# Altium project Zillion.PrjPcb
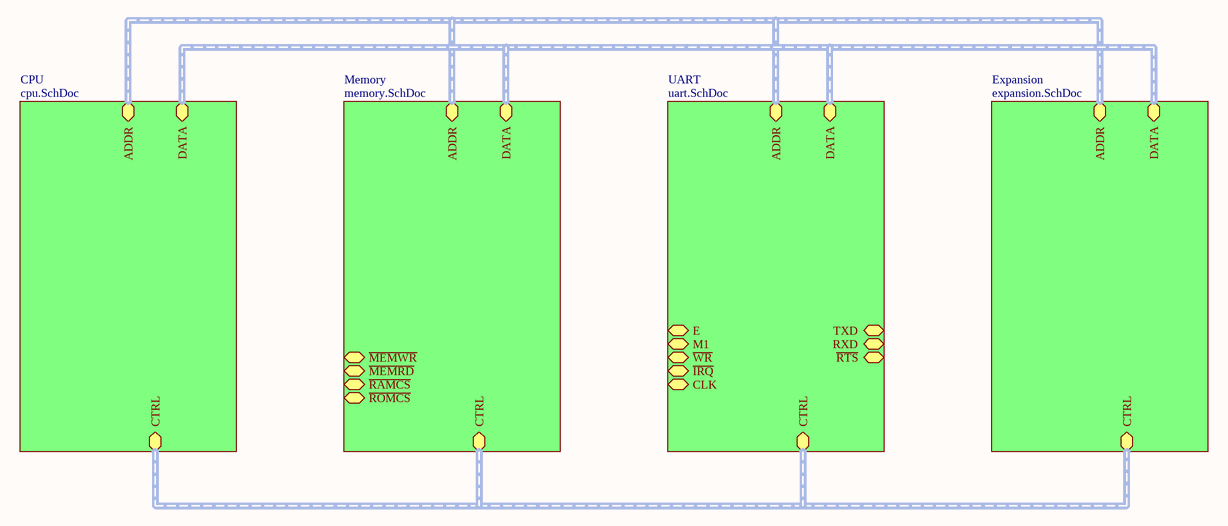
[diagram p0: Zillion.SchDoc]
5 sheets, 78 parts. Net scope: hierarchical (ports join the sheet entries above them; power ports are global).
Board file: Zillion.PcbDoc
Sheets:
  Zillion.SchDoc
    CPU = cpu.SchDoc
    Memory = memory.SchDoc
    UART = uart.SchDoc
    Expansion = expansion.SchDoc

## Sheet Zillion.SchDoc: Zillion - Z80 Single Board Computer
size A4; Author: Francesco Sacco; Revision: 0; ProjectName: Zillion - Z80 Single Board Computer

### Sub-sheets
CPU = cpu.SchDoc: ADDR (harness ADDR), DATA (harness DATA), CTRL (harness CTRL)
Expansion = expansion.SchDoc: ADDR (harness ADDR), DATA (harness DATA), CTRL (harness CTRL)
Memory = memory.SchDoc: ADDR (harness ADDR), DATA (harness DATA), CTRL (harness CTRL), ~{MEMWR}, ~{MEMRD}, ~{RAMCS}, ~{ROMCS}
UART = uart.SchDoc: ADDR (harness ADDR), DATA (harness DATA), CTRL (harness CTRL), E, M1, ~{WR}, ~{IRQ}, CLK, ~{RTS}, TXD, RXD

### Buses and harness runs
harness sheet CPU/ADDR = sheet Expansion/ADDR = sheet Memory/ADDR = sheet UART/ADDR
harness sheet CPU/CTRL = sheet Expansion/CTRL = sheet Memory/CTRL = sheet UART/CTRL
harness sheet CPU/DATA = sheet Expansion/DATA = sheet Memory/DATA = sheet UART/DATA

## Sheet cpu.SchDoc: Zillion - Z80 Single Board Computer
size A4; Author: Francesco Sacco; Revision: 0; ProjectName: Zillion - Z80 Single Board Computer
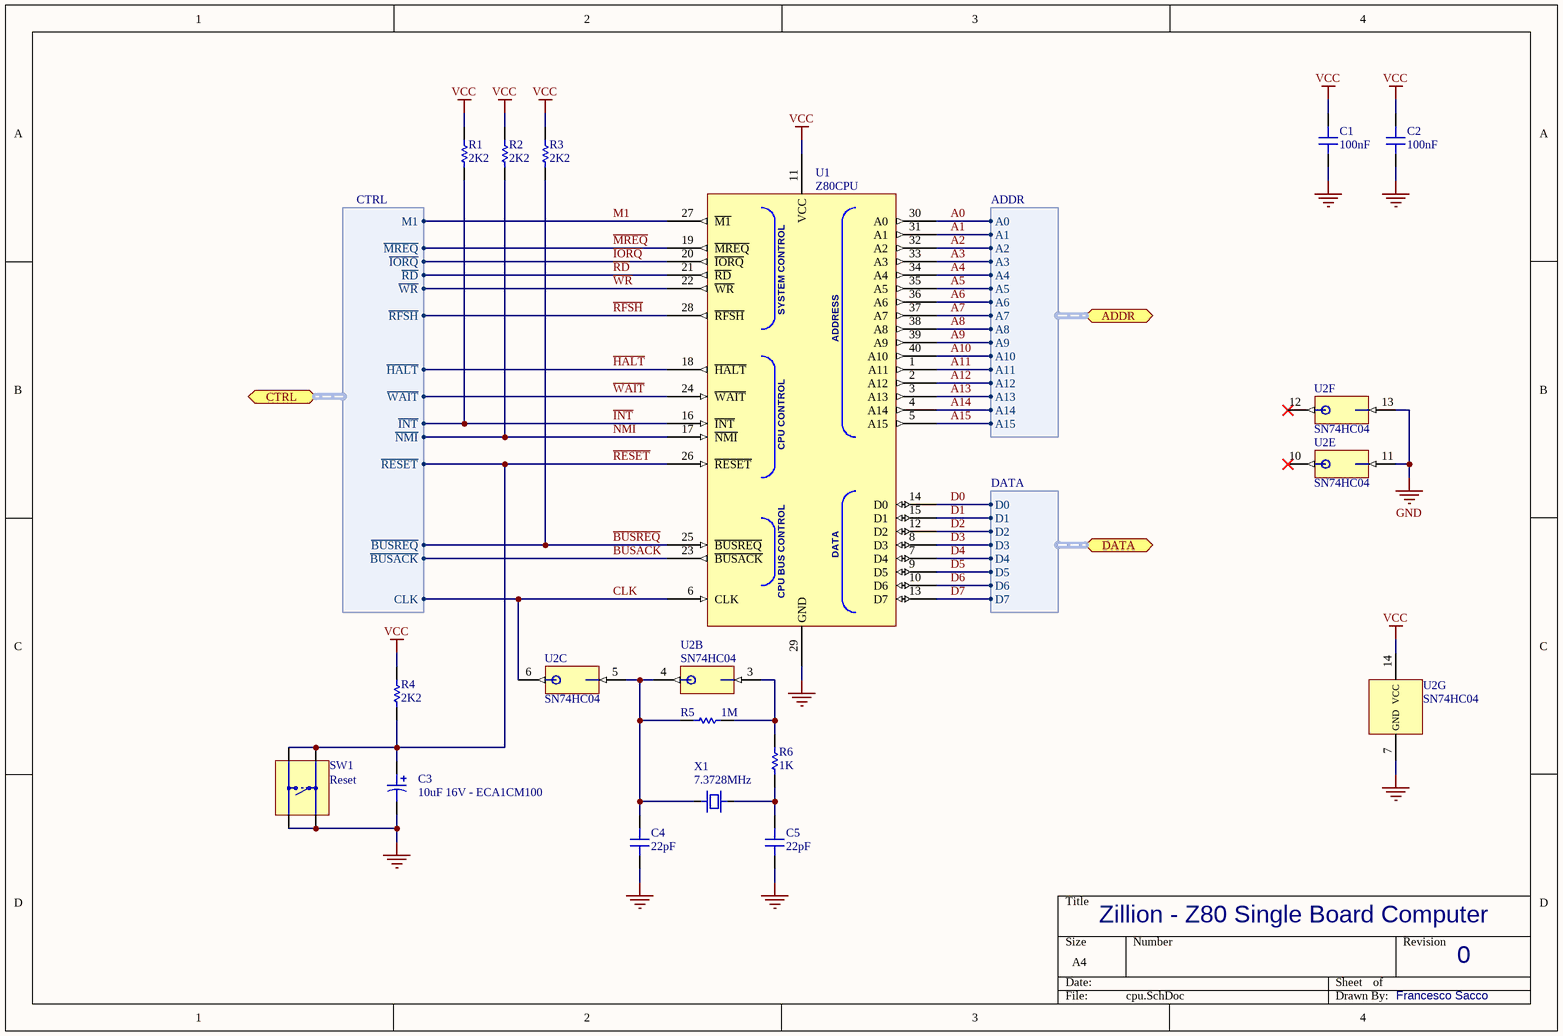
[diagram p1: cpu.SchDoc]

### Parts
C1  100nF  [DiskCapacitor]
C2  100nF  [DiskCapacitor]
C3  10uF 16V - ECA1CM100  [ECA 5x11]
C4  22pF  [DiskCapacitor]
C5  22pF  [DiskCapacitor]
R1  2K2  [CR12]
R2  2K2  [CR12]
R3  2K2  [CR12]
R4  2K2  [CR12]
R5  1M  [CR12]
R6  1K  [CR12]
SW1  Reset  [EVQPAx09K]
U1  Z80CPU  [Z84C00xxPEG]
U2  SN74HC04  [CDIP14]  (parts B,C,E,F,G of 7)
X1  7.3728MHz  [HC49S]

### Ports
ADDR (harness ADDR), CTRL (harness CTRL), DATA (harness DATA)

### Harnesses
ADDR: A0, A1, A2, A3, A4, A5, A6, A7, A8, A9, A10, A11, A12, A13, A14, A15
DATA: D0, D1, D2, D3, D4, D5, D6, D7
CTRL: M1, ~{MREQ}, ~{IORQ}, ~{RD}, ~{WR}, ~{RFSH}, ~{HALT}, ~{WAIT}, ~{INT}, ~{NMI}, ~{RESET}, ~{BUSREQ}, ~{BUSACK}, CLK

### Nets
GND: C1.1 C2.1 C3.2 C4.1 C5.1 SW1.1 SW1.2 U1.29(GND) U2.7(GND) U2.11(A) U2.13(A)
VCC: C1.2 C2.2 R1.2 R2.2 R3.2 R4.2 U1.11(VCC) U2.14(VCC)
A0: U1.30(A0) ; port ADDR.A0
A1: U1.31(A1) ; port ADDR.A1
A2: U1.32(A2) ; port ADDR.A2
A3: U1.33(A3) ; port ADDR.A3
A4: U1.34(A4) ; port ADDR.A4
A5: U1.35(A5) ; port ADDR.A5
A6: U1.36(A6) ; port ADDR.A6
A7: U1.37(A7) ; port ADDR.A7
A8: U1.38(A8) ; port ADDR.A8
A9: U1.39(A9) ; port ADDR.A9
A10: U1.40(A10) ; port ADDR.A10
A11: U1.1(A11) ; port ADDR.A11
A12: U1.2(A12) ; port ADDR.A12
A13: U1.3(A13) ; port ADDR.A13
A14: U1.4(A14) ; port ADDR.A14
A15: U1.5(A15) ; port ADDR.A15
~{BUSACK}: U1.23(~{BUSACK}) ; port CTRL.~{BUSACK}
~{BUSREQ}: R3.1 U1.25(~{BUSREQ}) ; port CTRL.~{BUSREQ}
CLK: U1.6(CLK) U2.6(Y) ; port CTRL.CLK
D0: U1.14(D0) ; port DATA.D0
D1: U1.15(D1) ; port DATA.D1
D2: U1.12(D2) ; port DATA.D2
D3: U1.8(D3) ; port DATA.D3
D4: U1.7(D4) ; port DATA.D4
D5: U1.9(D5) ; port DATA.D5
D6: U1.10(D6) ; port DATA.D6
D7: U1.13(D7) ; port DATA.D7
~{HALT}: U1.18(~{HALT}) ; port CTRL.~{HALT}
~{INT}: R1.1 U1.16(~{INT}) ; port CTRL.~{INT}
~{IORQ}: U1.20(~{IORQ}) ; port CTRL.~{IORQ}
M1: U1.27(~{M1}) ; port CTRL.M1
~{MREQ}: U1.19(~{MREQ}) ; port CTRL.~{MREQ}
~{NMI}: R2.1 U1.17(~{NMI}) ; port CTRL.~{NMI}
~{RD}: U1.21(~{RD}) ; port CTRL.~{RD}
~{RESET}: C3.1 R4.1 SW1.3 SW1.4 U1.26(~{RESET}) ; port CTRL.~{RESET}
~{RFSH}: U1.28(~{RFSH}) ; port CTRL.~{RFSH}
~{WAIT}: U1.24(~{WAIT}) ; port CTRL.~{WAIT}
~{WR}: U1.22(~{WR}) ; port CTRL.~{WR}
NetC4_2: C4.2 R5.2 U2.4(Y) U2.5(A) X1.1
NetC5_2: C5.2 R6.1 X1.2
NetR5_1: R5.1 R6.2 U2.3(A)

Not connected (* = marked no-connect by the designer): U2 10(Y)* 12(Y)*

### Notes on the sheet
- (in symbol Z84C00xxPEG) SYSTEM CONTROL; ADDRESS; CPU CONTROL; DATA; CPU BUS CONTROL

### Library data of the parts
C1 C2 C4 C5 = Capacitor
C3 = ECA1CM100: 10uF 16V
R1-R4 = Resistor
R5 R6 = Resistor: 2K2
SW1 = EVQPA: 5N Type Light Touch Switches
U1 = Z84C00xxPEG: Z80 - CPU
U2 = SN74HC04: Hex Inverters
X1 = HC49S: Crystal HC49S

## Sheet memory.SchDoc: Zillion - Z80 Single Board Computer
size A4; Author: Francesco Sacco; Revision: 0; ProjectName: Zillion - Z80 Single Board Computer
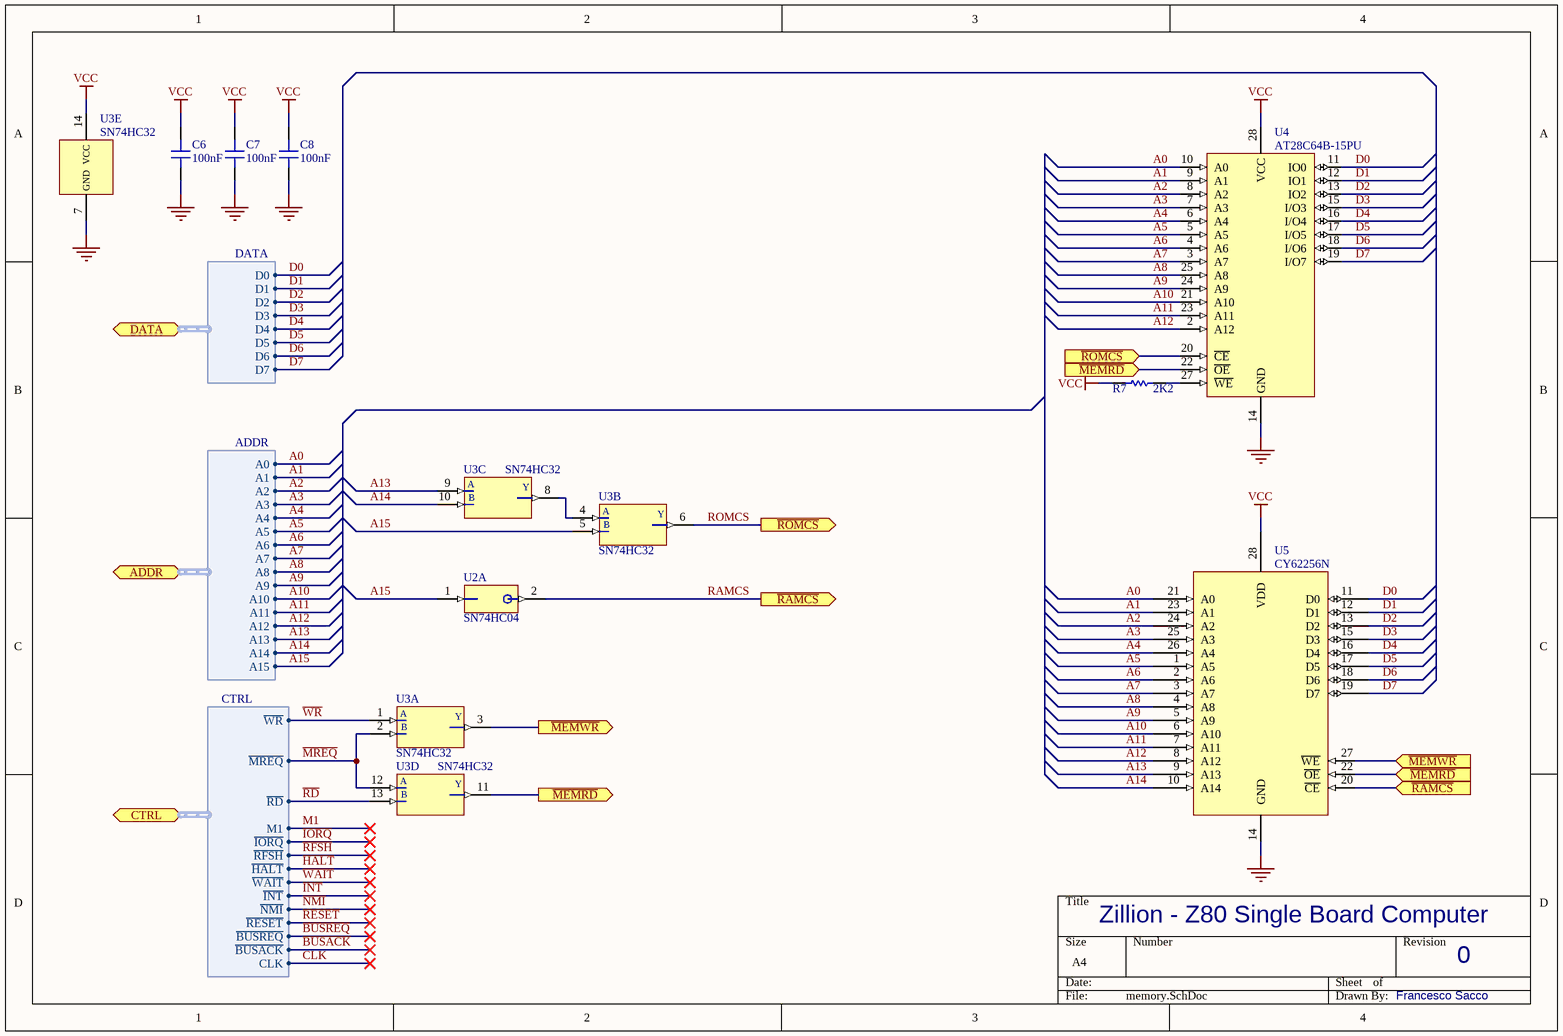
[diagram p2: memory.SchDoc]

### Parts
C6  100nF  [DiskCapacitor]
C7  100nF  [DiskCapacitor]
C8  100nF  [DiskCapacitor]
R7  2K2  [CR12]
U2  SN74HC04  [CDIP14]  (part A of 7)
U3  SN74HC32  [CDIP14]  (parts A,B,C,D,E of 5)
U4  AT28C64B-15PU  [PDIP28]
U5  CY62256N  [PDIP28]

### Ports
ADDR (harness ADDR), CTRL (harness CTRL), DATA (harness DATA), ~{MEMRD} (in), ~{MEMRD} (out), ~{MEMWR} (in), ~{MEMWR} (out), ~{RAMCS} (in), ~{RAMCS} (out), ~{ROMCS} (in), ~{ROMCS} (out)

### Harnesses
ADDR: A0, A1, A2, A3, A4, A5, A6, A7, A8, A9, A10, A11, A12, A13, A14, A15
DATA: D0, D1, D2, D3, D4, D5, D6, D7
CTRL: M1, ~{MREQ}, ~{IORQ}, ~{RD}, ~{WR}, ~{RFSH}, ~{HALT}, ~{WAIT}, ~{INT}, ~{NMI}, ~{RESET}, ~{BUSREQ}, ~{BUSACK}, CLK

### Nets
GND: C6.1 C7.1 C8.1 U3.7(GND) U4.14(GND) U5.14(GND)
VCC: C6.2 C7.2 C8.2 R7.2 U3.14(VCC) U4.28(VCC) U5.28(VDD)
A0: U4.10(A0) U5.21(A0) ; port ADDR.A0
A1: U4.9(A1) U5.23(A1) ; port ADDR.A1
A2: U4.8(A2) U5.24(A2) ; port ADDR.A2
A3: U4.7(A3) U5.25(A3) ; port ADDR.A3
A4: U4.6(A4) U5.26(A4) ; port ADDR.A4
A5: U4.5(A5) U5.1(A5) ; port ADDR.A5
A6: U4.4(A6) U5.2(A6) ; port ADDR.A6
A7: U4.3(A7) U5.3(A7) ; port ADDR.A7
A8: U4.25(A8) U5.4(A8) ; port ADDR.A8
A9: U4.24(A9) U5.5(A9) ; port ADDR.A9
A10: U4.21(A10) U5.6(A10) ; port ADDR.A10
A11: U4.23(A11) U5.7(A11) ; port ADDR.A11
A12: U4.2(A12) U5.8(A12) ; port ADDR.A12
A13: U3.9(A) U5.9(A13) ; port ADDR.A13
A14: U3.10(B) U5.10(A14) ; port ADDR.A14
A15: U2.1(A) U3.5(B) ; port ADDR.A15
D0: U4.11(IO0) U5.11(D0) ; port DATA.D0
D1: U4.12(IO1) U5.12(D1) ; port DATA.D1
D2: U4.13(IO2) U5.13(D2) ; port DATA.D2
D3: U4.15(I/O3) U5.15(D3) ; port DATA.D3
D4: U4.16(I/O4) U5.16(D4) ; port DATA.D4
D5: U4.17(I/O5) U5.17(D5) ; port DATA.D5
D6: U4.18(I/O6) U5.18(D6) ; port DATA.D6
D7: U4.19(I/O7) U5.19(D7) ; port DATA.D7
~{MREQ}: U3.2(B) U3.12(A) ; port CTRL.~{MREQ}
~{RD}: U3.13(B) ; port CTRL.~{RD}
RAMCS: U2.2(Y) U5.20(~{CE}) ; port ~{RAMCS}
ROMCS: U3.6(Y) U4.20(~{CE}) ; port ~{ROMCS}
~{WR}: U3.1(A) ; port CTRL.~{WR}
NetR7_1: R7.1 U4.27(~{WE})
NetU3_3: U3.3(Y) U5.27(~{WE}) ; port ~{MEMWR}
NetU3_4: U3.4(A) U3.8(Y)
NetU3_11: U3.11(Y) U4.22(~{OE}) U5.22(~{OE}) ; port ~{MEMRD}

### Library data of the parts
C6-C8 = Capacitor
R7 = Resistor
U2 = SN74HC04: Hex Inverters
U3 = SN74HC32: Quadruple 2-Input Positive-OR Gates
U4 = AT28C64B-15PU: 64K (8K x 8) Parallel EEPROM
U5 = CY62256N: 256-Kbit (32 K × 8) Static RAM

## Sheet uart.SchDoc: Zillion - Z80 Single Board Computer
size A4; Author: Francesco Sacco; Revision: 0; ProjectName: Zillion - Z80 Single Board Computer
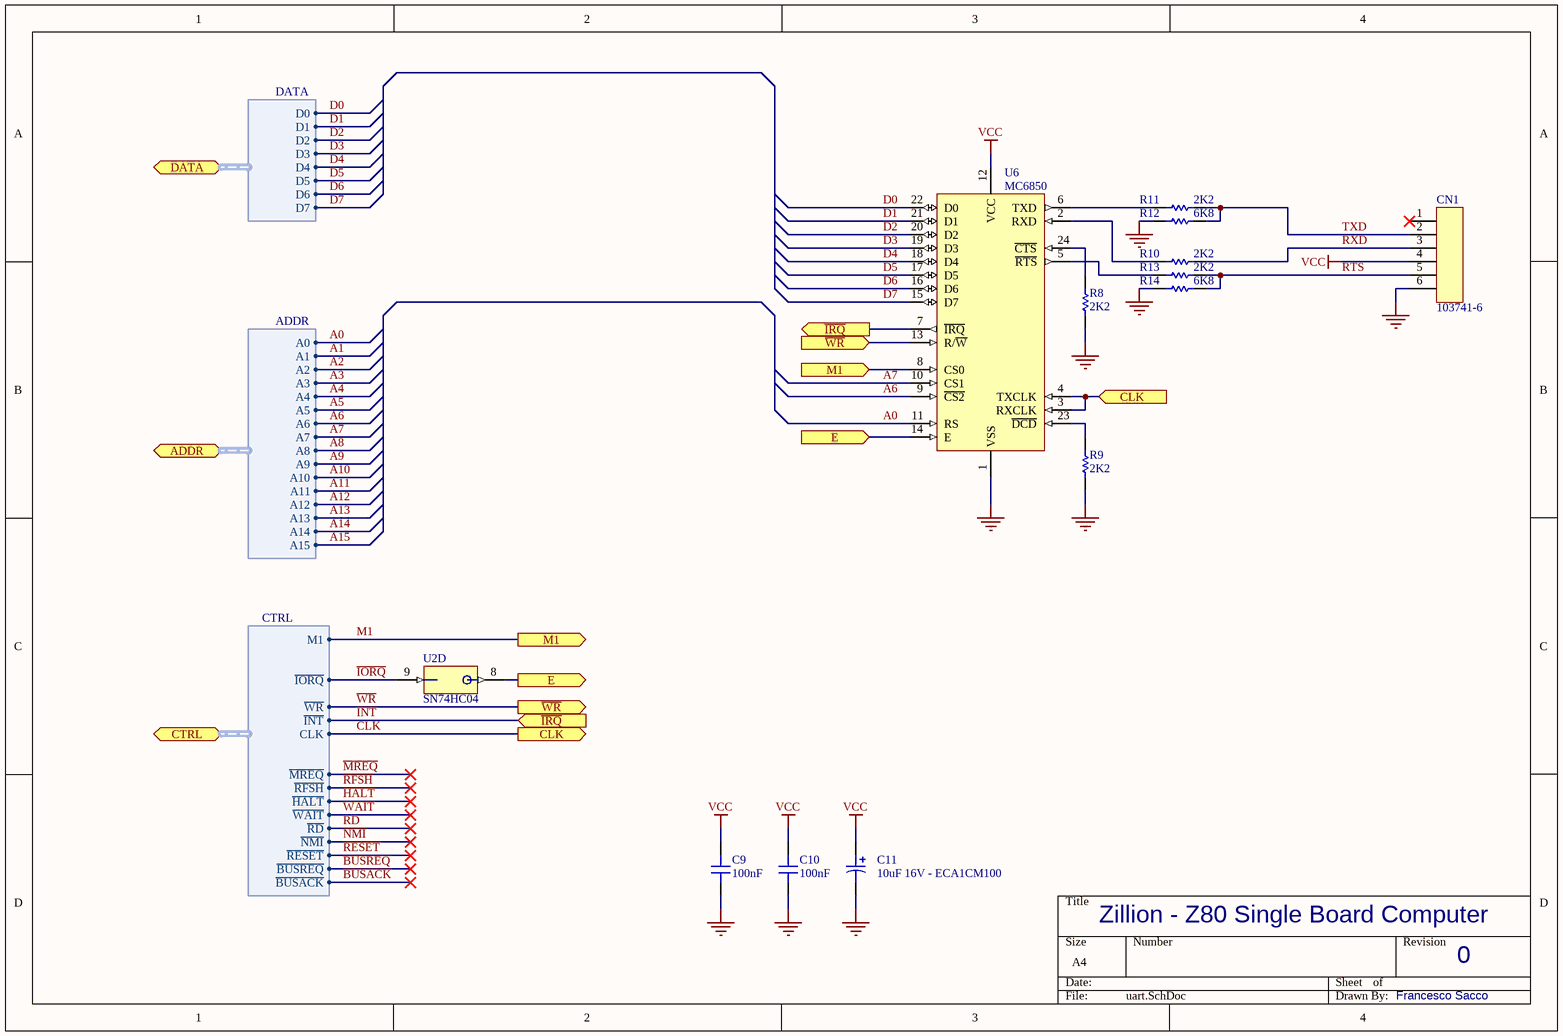
[diagram p3: uart.SchDoc]

### Parts
C9  100nF  [DiskCapacitor]
C10  100nF  [DiskCapacitor]
C11  10uF 16V - ECA1CM100  [ECA 5x11]
CN1  103741-6  [103741-6]
R8  2K2  [CR12]
R9  2K2  [CR12]
R10  2K2  [CR12]
R11  2K2  [CR12]
R12  6K8  [CR12]
R13  2K2  [CR12]
R14  6K8  [CR12]
U2  SN74HC04  [TSSOP14]  (part D of 7)
U6  MC6850  [PDIP24]

### Ports
ADDR (harness ADDR), CLK (in), CLK (out), CTRL (harness CTRL), DATA (harness DATA), E (in), E (out), M1 (in), M1 (out), ~{IRQ} (in), ~{IRQ} (out), ~{WR} (in), ~{WR} (out)

### Harnesses
ADDR: A0, A1, A2, A3, A4, A5, A6, A7, A8, A9, A10, A11, A12, A13, A14, A15
DATA: D0, D1, D2, D3, D4, D5, D6, D7
CTRL: M1, ~{MREQ}, ~{IORQ}, ~{RD}, ~{WR}, ~{RFSH}, ~{HALT}, ~{WAIT}, ~{INT}, ~{NMI}, ~{RESET}, ~{BUSREQ}, ~{BUSACK}, CLK

### Nets
GND: C9.1 C10.1 C11.2 CN1.6 R8.1 R9.1 R12.1 R14.1 U6.1(VSS)
VCC: C9.2 C10.2 C11.1 CN1.4 U6.12(VCC)
A0: U6.11(RS) ; port ADDR.A0
A6: U6.9(~{CS2}) ; port ADDR.A6
A7: U6.10(CS1) ; port ADDR.A7
CLK: U6.3(RXCLK) U6.4(TXCLK) ; port CLK, port CTRL.CLK
D0: U6.22(D0) ; port DATA.D0
D1: U6.21(D1) ; port DATA.D1
D2: U6.20(D2) ; port DATA.D2
D3: U6.19(D3) ; port DATA.D3
D4: U6.18(D4) ; port DATA.D4
D5: U6.17(D5) ; port DATA.D5
D6: U6.16(D6) ; port DATA.D6
D7: U6.15(D7) ; port DATA.D7
~{INT}: U6.7(~{IRQ}) ; port ~{IRQ}, port CTRL.~{INT}
~{IORQ}: U2.9(A) ; port CTRL.~{IORQ}
M1: U6.8(CS0) ; port M1, port CTRL.M1
RTS: CN1.5 R13.1 R14.2
RXD: CN1.3 R10.1
TXD: CN1.2 R11.1 R12.2
~{WR}: U6.13(R/~{W}) ; port ~{WR}, port CTRL.~{WR}
NetR8_2: R8.2 U6.24(~{CTS})
NetR9_2: R9.2 U6.23(~{DCD})
NetR10_2: R10.2 U6.2(RXD)
NetR11_2: R11.2 U6.6(TXD)
NetR13_2: R13.2 U6.5(~{RTS})
NetU2_8: U2.8(Y) U6.14(E) ; port E

Not connected (* = marked no-connect by the designer): CN1 1*

### Library data of the parts
C9 C10 = Capacitor
C11 = ECA1CM100: 10uF 16V
CN1 = 103741-6: CONN Breakaway Single Row
R8-R14 = Resistor
U2 = SN74HC04: Hex Inverters
U6 = MC6850: Asynchronous Communications Interface Adapter (ACIA)

## Sheet expansion.SchDoc: Zillion - Z80 Single Board Computer
size A4; Author: Francesco Sacco; Revision: 0; ProjectName: Zillion - Z80 Single Board Computer
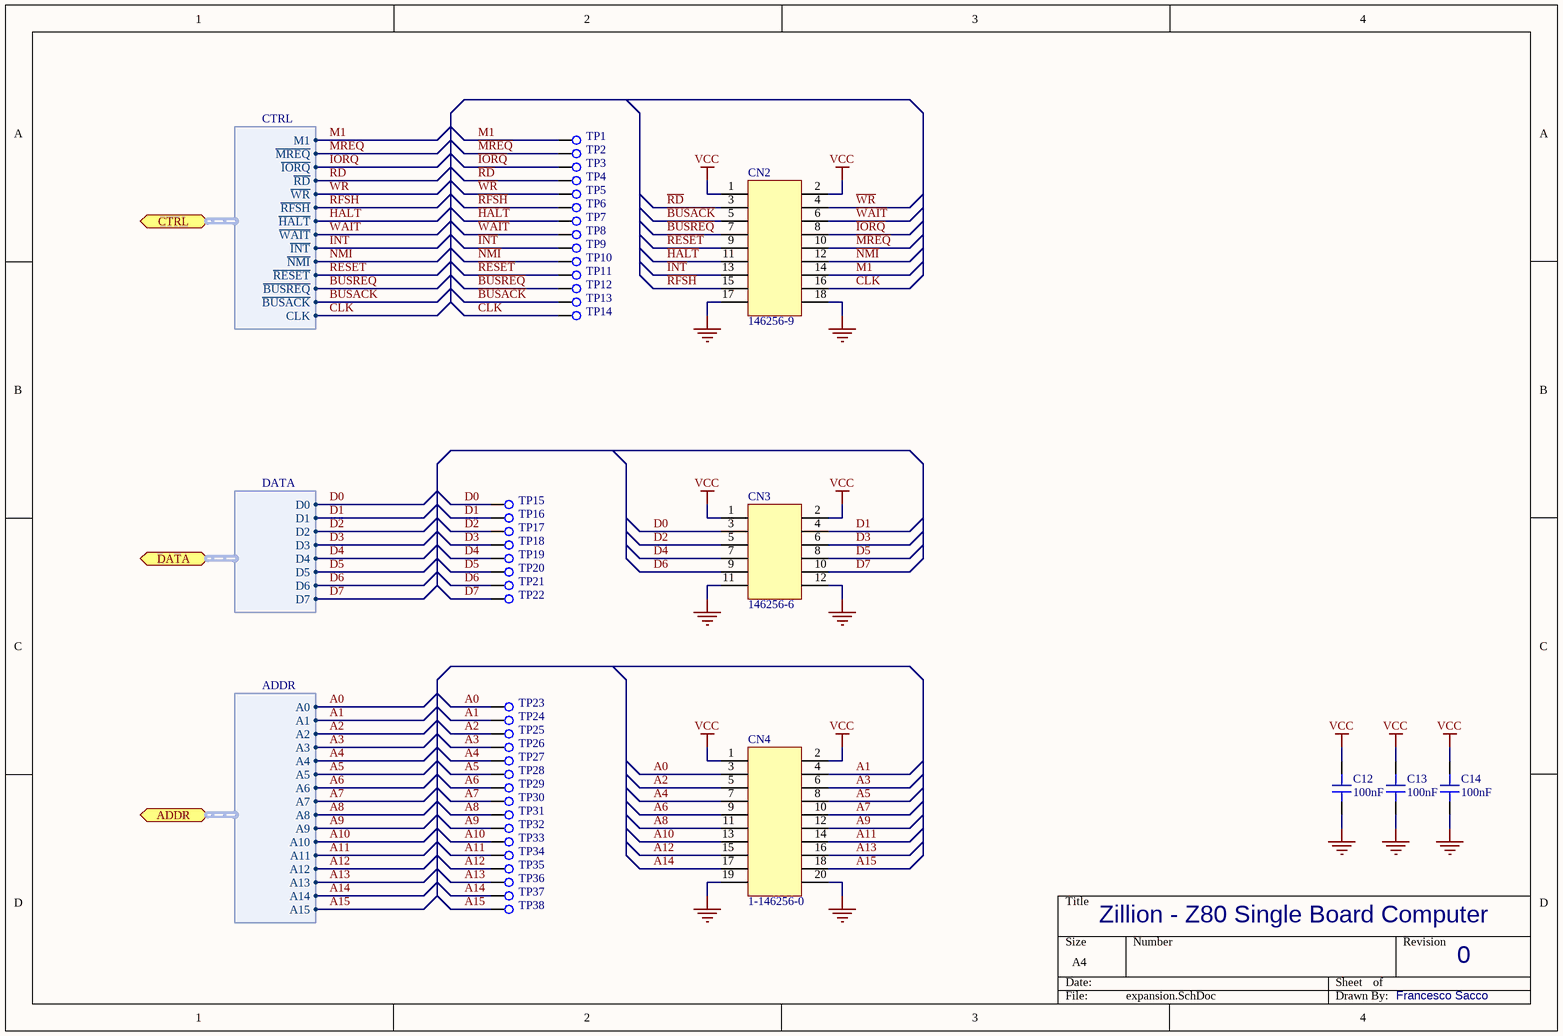
[diagram p4: expansion.SchDoc]

### Parts
C12  100nF  [DiskCapacitor]
C13  100nF  [DiskCapacitor]
C14  100nF  [DiskCapacitor]
CN2  146256-9  [146256-9]
CN3  146256-6  [146256-6]
CN4  1-146256-0  [1-146256-0]
TP1  Test Point  [Test Point Trace]  (value not drawn)
TP2  Test Point  [Test Point Trace]  (value not drawn)
TP3  Test Point  [Test Point Trace]  (value not drawn)
TP4  Test Point  [Test Point Trace]  (value not drawn)
TP5  Test Point  [Test Point Trace]  (value not drawn)
TP6  Test Point  [Test Point Trace]  (value not drawn)
TP7  Test Point  [Test Point Trace]  (value not drawn)
TP8  Test Point  [Test Point Trace]  (value not drawn)
TP9  Test Point  [Test Point Trace]  (value not drawn)
TP10  Test Point  [Test Point Trace]  (value not drawn)
TP11  Test Point  [Test Point Trace]  (value not drawn)
TP12  Test Point  [Test Point Trace]  (value not drawn)
TP13  Test Point  [Test Point Trace]  (value not drawn)
TP14  Test Point  [Test Point Trace]  (value not drawn)
TP15  Test Point  [Test Point Trace]  (value not drawn)
TP16  Test Point  [Test Point Trace]  (value not drawn)
TP17  Test Point  [Test Point Trace]  (value not drawn)
TP18  Test Point  [Test Point Trace]  (value not drawn)
TP19  Test Point  [Test Point Trace]  (value not drawn)
TP20  Test Point  [Test Point Trace]  (value not drawn)
TP21  Test Point  [Test Point Trace]  (value not drawn)
TP22  Test Point  [Test Point Trace]  (value not drawn)
TP23  Test Point  [Test Point Trace]  (value not drawn)
TP24  Test Point  [Test Point Trace]  (value not drawn)
TP25  Test Point  [Test Point Trace]  (value not drawn)
TP26  Test Point  [Test Point Trace]  (value not drawn)
TP27  Test Point  [Test Point Trace]  (value not drawn)
TP28  Test Point  [Test Point Trace]  (value not drawn)
TP29  Test Point  [Test Point Trace]  (value not drawn)
TP30  Test Point  [Test Point Trace]  (value not drawn)
TP31  Test Point  [Test Point Trace]  (value not drawn)
TP32  Test Point  [Test Point Trace]  (value not drawn)
TP33  Test Point  [Test Point Trace]  (value not drawn)
TP34  Test Point  [Test Point Trace]  (value not drawn)
TP35  Test Point  [Test Point Trace]  (value not drawn)
TP36  Test Point  [Test Point Trace]  (value not drawn)
TP37  Test Point  [Test Point Trace]  (value not drawn)
TP38  Test Point  [Test Point Trace]  (value not drawn)

### Ports
ADDR (harness ADDR), CTRL (harness CTRL), DATA (harness DATA)

### Harnesses
CTRL: M1, ~{MREQ}, ~{IORQ}, ~{RD}, ~{WR}, ~{RFSH}, ~{HALT}, ~{WAIT}, ~{INT}, ~{NMI}, ~{RESET}, ~{BUSREQ}, ~{BUSACK}, CLK
ADDR: A0, A1, A2, A3, A4, A5, A6, A7, A8, A9, A10, A11, A12, A13, A14, A15
DATA: D0, D1, D2, D3, D4, D5, D6, D7

### Nets
GND: C12.1 C13.1 C14.1 CN2.17 CN2.18 CN3.11 CN3.12 CN4.19 CN4.20
VCC: C12.2 C13.2 C14.2 CN2.1 CN2.2 CN3.1 CN3.2 CN4.1 CN4.2
A0: CN4.3 TP23.1 ; port ADDR.A0
A1: CN4.4 TP24.1 ; port ADDR.A1
A2: CN4.5 TP25.1 ; port ADDR.A2
A3: CN4.6 TP26.1 ; port ADDR.A3
A4: CN4.7 TP27.1 ; port ADDR.A4
A5: CN4.8 TP28.1 ; port ADDR.A5
A6: CN4.9 TP29.1 ; port ADDR.A6
A7: CN4.10 TP30.1 ; port ADDR.A7
A8: CN4.11 TP31.1 ; port ADDR.A8
A9: CN4.12 TP32.1 ; port ADDR.A9
A10: CN4.13 TP33.1 ; port ADDR.A10
A11: CN4.14 TP34.1 ; port ADDR.A11
A12: CN4.15 TP35.1 ; port ADDR.A12
A13: CN4.16 TP36.1 ; port ADDR.A13
A14: CN4.17 TP37.1 ; port ADDR.A14
A15: CN4.18 TP38.1 ; port ADDR.A15
~{BUSACK}: CN2.5 TP13.1 ; port CTRL.~{BUSACK}
~{BUSREQ}: CN2.7 TP12.1 ; port CTRL.~{BUSREQ}
CLK: CN2.16 TP14.1 ; port CTRL.CLK
D0: CN3.3 TP15.1 ; port DATA.D0
D1: CN3.4 TP16.1 ; port DATA.D1
D2: CN3.5 TP17.1 ; port DATA.D2
D3: CN3.6 TP18.1 ; port DATA.D3
D4: CN3.7 TP19.1 ; port DATA.D4
D5: CN3.8 TP20.1 ; port DATA.D5
D6: CN3.9 TP21.1 ; port DATA.D6
D7: CN3.10 TP22.1 ; port DATA.D7
~{HALT}: CN2.11 TP7.1 ; port CTRL.~{HALT}
~{INT}: CN2.13 TP9.1 ; port CTRL.~{INT}
~{IORQ}: CN2.8 TP3.1 ; port CTRL.~{IORQ}
M1: CN2.14 TP1.1 ; port CTRL.M1
~{MREQ}: CN2.10 TP2.1 ; port CTRL.~{MREQ}
~{NMI}: CN2.12 TP10.1 ; port CTRL.~{NMI}
~{RD}: CN2.3 TP4.1 ; port CTRL.~{RD}
~{RESET}: CN2.9 TP11.1 ; port CTRL.~{RESET}
~{RFSH}: CN2.15 TP6.1 ; port CTRL.~{RFSH}
~{WAIT}: CN2.6 TP8.1 ; port CTRL.~{WAIT}
~{WR}: CN2.4 TP5.1 ; port CTRL.~{WR}

### Library data of the parts
C12-C14 = Capacitor
CN2 = 146256-9: CONN Header Breakaway
CN3 = 146256-6: CONN Header Breakaway
CN4 = 1-146256-0: CONN Header Breakaway

## Nets that join several sheets
GND: cpu (11 pins), memory (6 pins), uart (9 pins), expansion (9 pins)
VCC: cpu (8 pins), memory (7 pins), uart (5 pins), expansion (9 pins)
A0: cpu (U1.30), memory (U4.10 U5.21), uart (U6.11), expansion (CN4.3 TP23.1)
A1: cpu (U1.31), memory (U4.9 U5.23), expansion (CN4.4 TP24.1)
A2: cpu (U1.32), memory (U4.8 U5.24), expansion (CN4.5 TP25.1)
A3: cpu (U1.33), memory (U4.7 U5.25), expansion (CN4.6 TP26.1)
A4: cpu (U1.34), memory (U4.6 U5.26), expansion (CN4.7 TP27.1)
A5: cpu (U1.35), memory (U4.5 U5.1), expansion (CN4.8 TP28.1)
A6: cpu (U1.36), memory (U4.4 U5.2), uart (U6.9), expansion (CN4.9 TP29.1)
A7: cpu (U1.37), memory (U4.3 U5.3), uart (U6.10), expansion (CN4.10 TP30.1)
A8: cpu (U1.38), memory (U4.25 U5.4), expansion (CN4.11 TP31.1)
A9: cpu (U1.39), memory (U4.24 U5.5), expansion (CN4.12 TP32.1)
A10: cpu (U1.40), memory (U4.21 U5.6), expansion (CN4.13 TP33.1)
A11: cpu (U1.1), memory (U4.23 U5.7), expansion (CN4.14 TP34.1)
A12: cpu (U1.2), memory (U4.2 U5.8), expansion (CN4.15 TP35.1)
A13: cpu (U1.3), memory (U3.9 U5.9), expansion (CN4.16 TP36.1)
A14: cpu (U1.4), memory (U3.10 U5.10), expansion (CN4.17 TP37.1)
A15: cpu (U1.5), memory (U2.1 U3.5), expansion (CN4.18 TP38.1)
~{BUSACK}: cpu (U1.23), expansion (CN2.5 TP13.1)
~{BUSREQ}: cpu (R3.1 U1.25), expansion (CN2.7 TP12.1)
CLK: cpu (U1.6 U2.6), uart (U6.3 U6.4), expansion (CN2.16 TP14.1)
D0: cpu (U1.14), memory (U4.11 U5.11), uart (U6.22), expansion (CN3.3 TP15.1)
D1: cpu (U1.15), memory (U4.12 U5.12), uart (U6.21), expansion (CN3.4 TP16.1)
D2: cpu (U1.12), memory (U4.13 U5.13), uart (U6.20), expansion (CN3.5 TP17.1)
D3: cpu (U1.8), memory (U4.15 U5.15), uart (U6.19), expansion (CN3.6 TP18.1)
D4: cpu (U1.7), memory (U4.16 U5.16), uart (U6.18), expansion (CN3.7 TP19.1)
D5: cpu (U1.9), memory (U4.17 U5.17), uart (U6.17), expansion (CN3.8 TP20.1)
D6: cpu (U1.10), memory (U4.18 U5.18), uart (U6.16), expansion (CN3.9 TP21.1)
D7: cpu (U1.13), memory (U4.19 U5.19), uart (U6.15), expansion (CN3.10 TP22.1)
~{HALT}: cpu (U1.18), expansion (CN2.11 TP7.1)
~{INT}: cpu (R1.1 U1.16), uart (U6.7), expansion (CN2.13 TP9.1)
~{IORQ}: cpu (U1.20), uart (U2.9), expansion (CN2.8 TP3.1)
M1: cpu (U1.27), uart (U6.8), expansion (CN2.14 TP1.1)
~{MREQ}: cpu (U1.19), memory (U3.2 U3.12), expansion (CN2.10 TP2.1)
~{NMI}: cpu (R2.1 U1.17), expansion (CN2.12 TP10.1)
~{RD}: cpu (U1.21), memory (U3.13), expansion (CN2.3 TP4.1)
~{RESET}: cpu (5 pins), expansion (CN2.9 TP11.1)
~{RFSH}: cpu (U1.28), expansion (CN2.15 TP6.1)
~{WAIT}: cpu (U1.24), expansion (CN2.6 TP8.1)
~{WR}: cpu (U1.22), memory (U3.1), uart (U6.13), expansion (CN2.4 TP5.1)